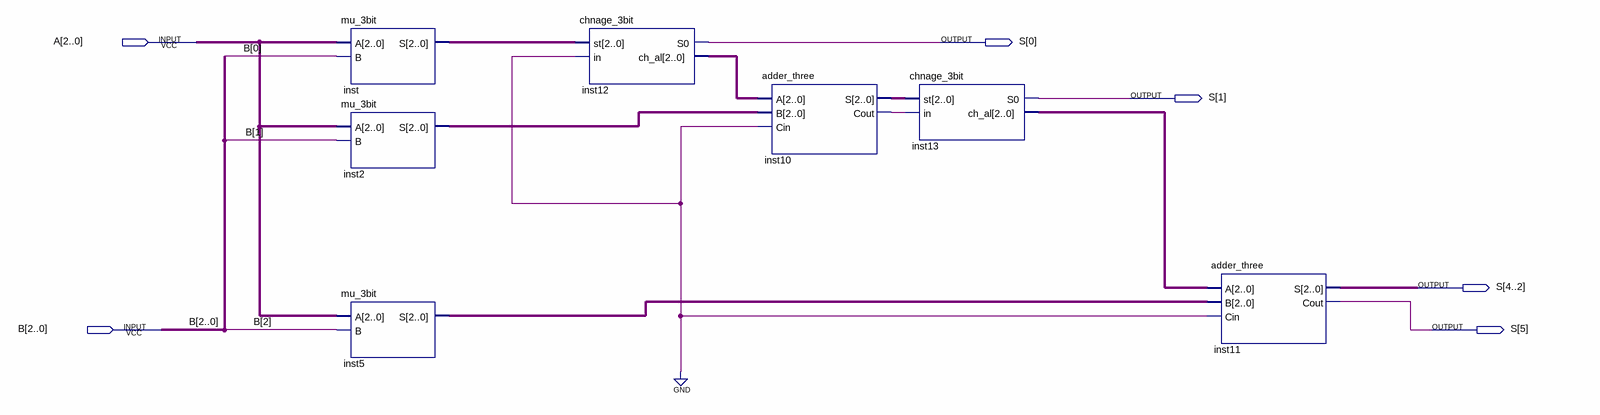
[diagram p0: schematic sheet]
// Quartus schematic mu_3bit_ins.bdf as structural Verilog: 7 symbols, 6 pins
module mu_3bit_ins (
  input  [2:0] A,
  input  [2:0] B,
  output [5:0] S
);

  wire inst10_cout;
  wire [2:0] inst2_s, inst5_s, inst10_s, inst12_ch_al, inst13_ch_al, inst_s;

  mu_3bit inst (.A(A), .B(B[0]), .S(inst_s));
  mu_3bit inst2 (.A(A), .B(B[1]), .S(inst2_s));
  mu_3bit inst5 (.A(A), .B(B[2]), .S(inst5_s));
  chnage_3bit inst12 (.st(inst_s), .in(1'b0), .S0(S[0]), .ch_al(inst12_ch_al));
  adder_three inst10 (.A(inst12_ch_al), .B(inst2_s), .Cin(1'b0), .S(inst10_s), .Cout(inst10_cout));
  chnage_3bit inst13 (.st(inst10_s), .in(inst10_cout), .S0(S[1]), .ch_al(inst13_ch_al));
  adder_three inst11 (.A(inst13_ch_al), .B(inst5_s), .Cin(1'b0), .S(S[4:2]), .Cout(S[5]));
endmodule
